# Altium schematic sheet Shema.SchDoc
size A4
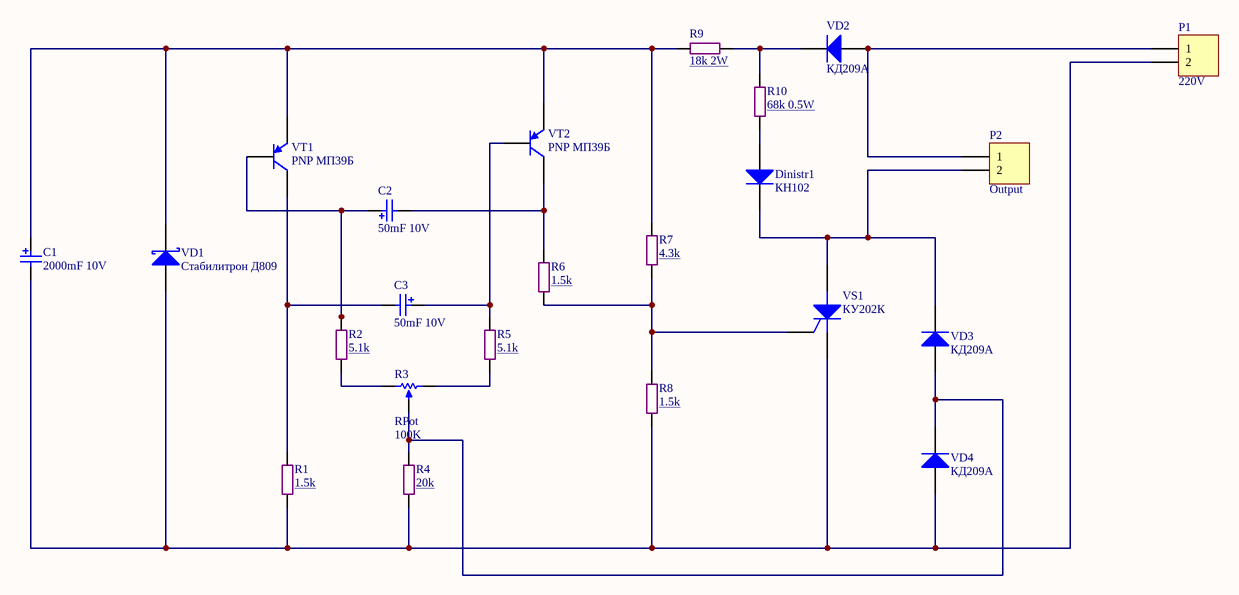
[diagram p0: Shema.SchDoc]

## Parts
C1  2000mF 10V  [Cap p7.62mm D16mm (4p)]
C2  50mF 10V  [Cap p2.54mm D5mm (2p)]
C3  50mF 10V  [Cap p2.54mm D5mm (2p)]
Dinistr1  КН102  [DO-41]
P1  220V  [HDR1X2]
P2  Output  [HDR1X2]
R1  1.5k  [Res p7.62]
R2  5.1k  [Res p7.62]
R3  RPot  value 100K  [VR5]
R4  20k  [Res p7.62]
R5  5.1k  [Res p7.62]
R6  1.5k  [Res p7.62]
R7  4.3k  [Res p7.62]
R8  1.5k  [Res p7.62]
R9  18k 2W  [Res p7.62]
R10  68k 0.5W  [Res p7.62]
VD1  Стабилитрон Д809  [DO-204AL]
VD2  КД209А  [DO-41]
VD3  КД209А  [DO-41]
VD4  КД209А  [DO-41]
VS1  КУ202К  [TO-220-AB]
VT1  PNP МП39Б  [SOT-23B_N]
VT2  PNP МП39Б  [SOT-23B_N]

## Nets
NetC1_1: C1.1 R7.2 R9.2 VD1.2(K) VT1.3(E) VT2.3(E)
NetC1_2: C1.2 P1.2 R1.1 R4.1 R8.1 VD1.1(A) VD4.1(A) VS1.3(K)
NetC2_1: C2.1 R2.2 VT1.2(B)
NetC2_2: C2.2 R6.2 VT2.1(C)
NetC3_1: C3.1 R5.2 VT2.2(B)
NetC3_2: C3.2 R1.2 VT1.1(C)
NetDinistr1_1: Dinistr1.1(A) R10.2
NetDinistr1_2: Dinistr1.2(K) P2.2 VD3.2(K) VS1.1(A)
NetP1_1: P1.1 P2.1 VD2.1(A)
NetR2_1: R2.1 R3.1(TOP)
NetR3_2: R3.2(BOT) R5.1
NetR3_3: R3.3(TAP) R4.2 VD3.1(A) VD4.2(K)
NetR6_1: R6.1 R7.1 R8.2 VS1.2(G)
NetR9_1: R9.1 R10.1 VD2.2(K)

## Library data of the parts
C1-C3 = Cap Cylinder: Capacitor Electrolitic
Dinistr1 VD2-VD4 = Diode 1N4002: 1 Amp General Purpose Rectifier; Published: 8-Jun-2000; LatestRevisionDate: 17-Jul-2002; LatestRevisionNote: Re-released for DXP Platform.; DatasheetVersion: 1998; PackageVersion: Aug-1999; PackageReference: DO-41; Publisher: Altium Limited; PackageDescription: Diode, Axial; Body 5.2 x 2.7 mm (LxDia. max), Lead Dia. 0.86 mm (max); Code_JEDEC: DO-204-AL; ComponentLink1Description: Manufacturer Link; ComponentLink1URL: http://www.fairchildsemi.com/; ComponentLink2Description: Datasheet; ComponentLink2URL: http://www.fairchildsemi.com/ds/1N%2F1N4001.pdf
P1 P2 = Header 2: Header, 2-Pin; LatestRevisionDate: 17-Jul-2002; LatestRevisionNote: Re-released for DXP Platform.; Publisher: Altium Limited
R1 R2 R4-R10 = Resistor
R3 = RPot: Potentiometer; Sim Note: Enter the Resistance value and the set point into parameter fields.; Set Position: 0.5; Published: 8-Jun-2000; LatestRevisionDate: 17-Jul-2002; LatestRevisionNote: Re-released for DXP Platform.; PackageReference: VR5; Publisher: Altium Limited; PackageDescription: Variable Resistor, Thru-Hole; 3 Leads
VD1 = Diode 11DQ03: Schottky Rectifier; Published: 8-Jun-2000; LatestRevisionDate: 17-Jul-2002; LatestRevisionNote: Re-released for DXP Platform.; DatasheetVersion: Dec-1997; PackageReference: DO-204AL; Publisher: Altium Limited; PackageDescription: Diode, Axial; Body 5.2 x 2.7 mm (LxDia. max), Lead Dia. 0.86 mm (max); Code_JEDEC: DO-204-AL; ComponentLink1Description: Manufacturer Link; ComponentLink1URL: http://www.irf.com/; ComponentLink2Description: Datasheet; ComponentLink2URL: http://www.irf.com/product-info/datasheets/data/11dq03.pdf
VS1 = SCR: Silicon Controlled Rectifier; Published: 8-Jun-2000; LatestRevisionDate: 17-Jul-2002; LatestRevisionNote: Re-released for DXP Platform.; PackageReference: TO-220-AB; Publisher: Altium Limited; Code_JEDEC: TO-220-AB
VT1 VT2 = PNP: PNP Bipolar Transistor; Published: 8-Jun-2000; LatestRevisionDate: 29-May-2009; LatestRevisionNote: IPC-7351 Footprint Added.; PackageVersion: Aug-1999; PackageReference: SOT-23B; Publisher: Altium Limited; PackageDescription: 3-Pin SOT-23 Package 0.95 mm Pitch, 2.4 mm Lead Span